# Altium schematic sheet 5V_2A_LDO_SUPPLY.SchDoc
size A
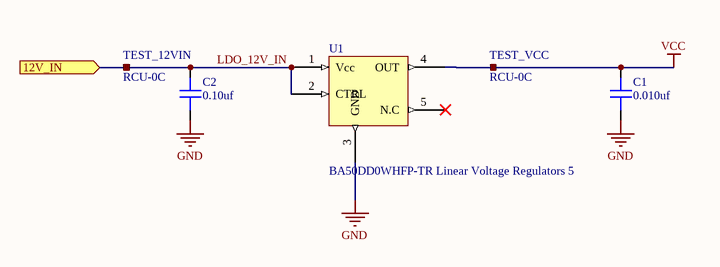
[diagram p0: 5V_2A_LDO_SUPPLY.SchDoc]

## Parts
C1  value 0.010uf  [CAP 0603/1608]  (hidden comment: Capacitor MLCC 0.010uf 16V CAP 0603/1608)
C2  value 0.10uf  [CAP 0603/1608]  (hidden comment: Capacitor MLCC 0.10uf 16V CAP 0603/1608)
TEST_12VIN  RCU-0C  [RCU-0C]
TEST_VCC  RCU-0C  [RCU-0C]
U1  BA50DD0WHFP-TR Linear Voltage Regulators 5  [HRP5]

## Ports
12V_IN (in)

## Nets
GND: C1.1 C2.1 U1.3(GND)
VCC: C1.2 TEST_VCC.1 U1.4(OUT)
LDO_12V_IN: C2.2 TEST_12VIN.1 U1.1(Vcc) U1.2(CTRL) ; port 12V_IN

Not connected (* = marked no-connect by the designer): U1 5(N.C)*

## Library data of the parts
C1 = 217: Manufacturer_id: 1; idCapacitor: 217; Name: Cap_0.010uf_16V_CAP 0603/1608; Dielectric: Ceramic; Created_By: Nick Mah; Drawer_id: 1; Voltage_Rating: 16V; Package: CAP 0603/1608; Created_Date: 10/20/2018
C2 = 223: Manufacturer_id: 1; idCapacitor: 223; Name: Cap_0.10uf_16V_CAP 0603/1608; Dielectric: Ceramic; Created_By: Nick Mah; Drawer_id: 1; Voltage_Rating: 16V; Package: CAP 0603/1608; Created_Date: 10/20/2018
TEST_12VIN TEST_VCC = 5: Manufacturer_id: 1; idTable: 5; Name: RCU-0C_Test_Point; Drawer_id: 1; Package: 0603; MfrPartNo: RCU-0C; Link: https://www.digikey.com/product-detail/en/te-connectivity-amp-connectors/RCU-0C/A106145CT-ND/3477802; ComponentLink1Description: Datasheet; ComponentLink1URL: https://www.te.com/commerce/DocumentDelivery/DDEController?Action=srchrtrv&DocNm=1773266&DocType=DS&DocLang=English
U1 = 6: Manufacturer_id: 1; idPMIC_Lin: 6; Name: 5V 2A LDO; Value: 5V 2.0A; Vin(Min): 3V; Vin(Max): 25V; Vout(Max): 5V; Current_Rating: 2A; Dropout_Voltage: 0.7V; Drawer_id: 1; Num_Outputs: 1; Package: TO-263-6; MfrPartNo: BA50DD0WHFP-TR; Link: https://www.mouser.com/ProductDetail/ROHM-Semiconductor/BA50DD0WHFP-TR?qs=4kLU8WoGk0sFpKnESpdNFg%3D%3D